# EAGLE schematic QUES -1 (2) (EAGLE 9.6.2)
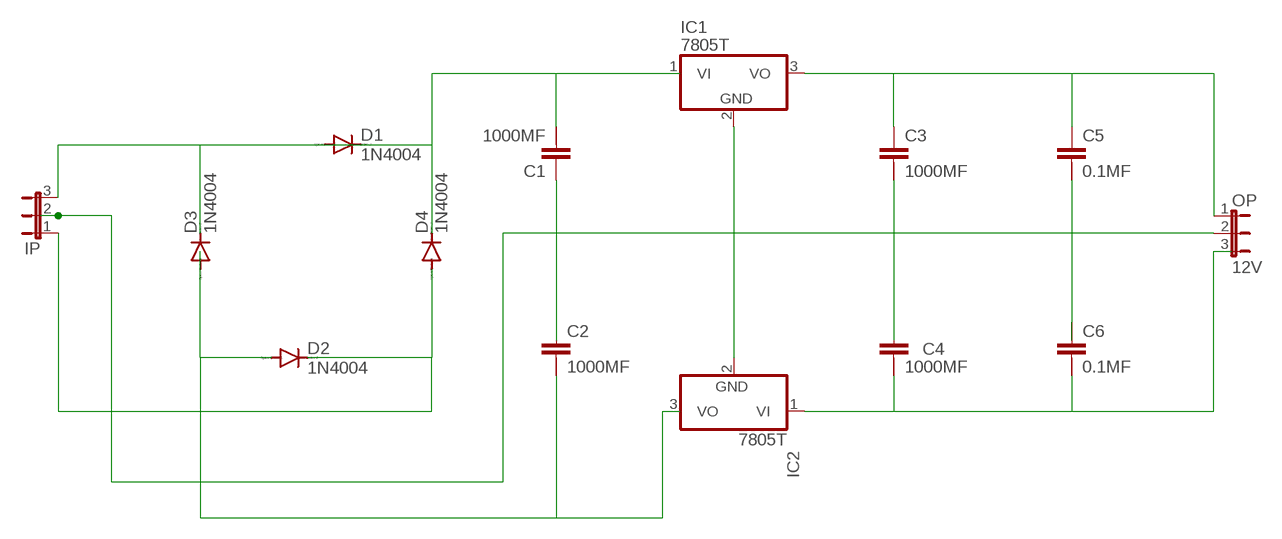
[diagram p0: schematic, sheet 1]

## Parts
C1  1000MF  C-2.5-5/2  [C2.5/5-2]
C2  1000MF  C-2.5-5/2  [C2.5/5-2]
C3  1000MF  C-2.5-5/2  [C2.5/5-2]
C4  1000MF  C-2.5-5/2  [C2.5/5-2]
C5  0.1MF  C-2.5-5/2  [C2.5/5-2]
C6  0.1MF  C-2.5-5/2  [C2.5/5-2]
D1  1N4004  [DO41-10]
D2  1N4004  [DO41-10]
D3  1N4004  [DO41-10]
D4  1N4004  [DO41-10]
IC1  7805T  [TO220H]
IC2  7805T  [TO220H]
IP  JP2E  [JP2]
OP  12V  JP2E  [JP2]

## Nets
N$2: C2.2 D2.A D3.A IC2.3(VO)
N$3: C3.1 C5.1 IC1.3(VO) OP.1
N$4: D2.C D4.A IP.1
N$5: C1.1 C2.1
N$6: C3.2 C4.1
N$7: IC1.2(GND) IC2.2(GND)
N$8: IP.2 OP.2
N$9: C4.2 C6.2 IC2.1(VI) OP.3
N$10: C5.2 C6.1
N$11: C1.2 D1.A D1.C D3.C D4.C IC1.1(VI) IP.3
Unconnected: C1.3 C2.3 C3.3 C4.3 C5.3 C6.3

## Library data of the parts
C1-C6 = capacitor-wima:C-: CAPACITOR for alternative placement naming: default grid - extended grid/package width
D1-D4 = diode:1N4004: DIODE general purpose rectifier, 1 A
IC1 IC2 = linear:78*: Positive VOLTAGE REGULATOR Source: http://cache.national.com/ds/LM/LM78L05.pdf http://www.fairchildsemi.com/ds/LM/LM7805.pdf
IP OP = jumper:JP2E: JUMPER